# EAGLE design control_rev_3 (EAGLE 6.3)
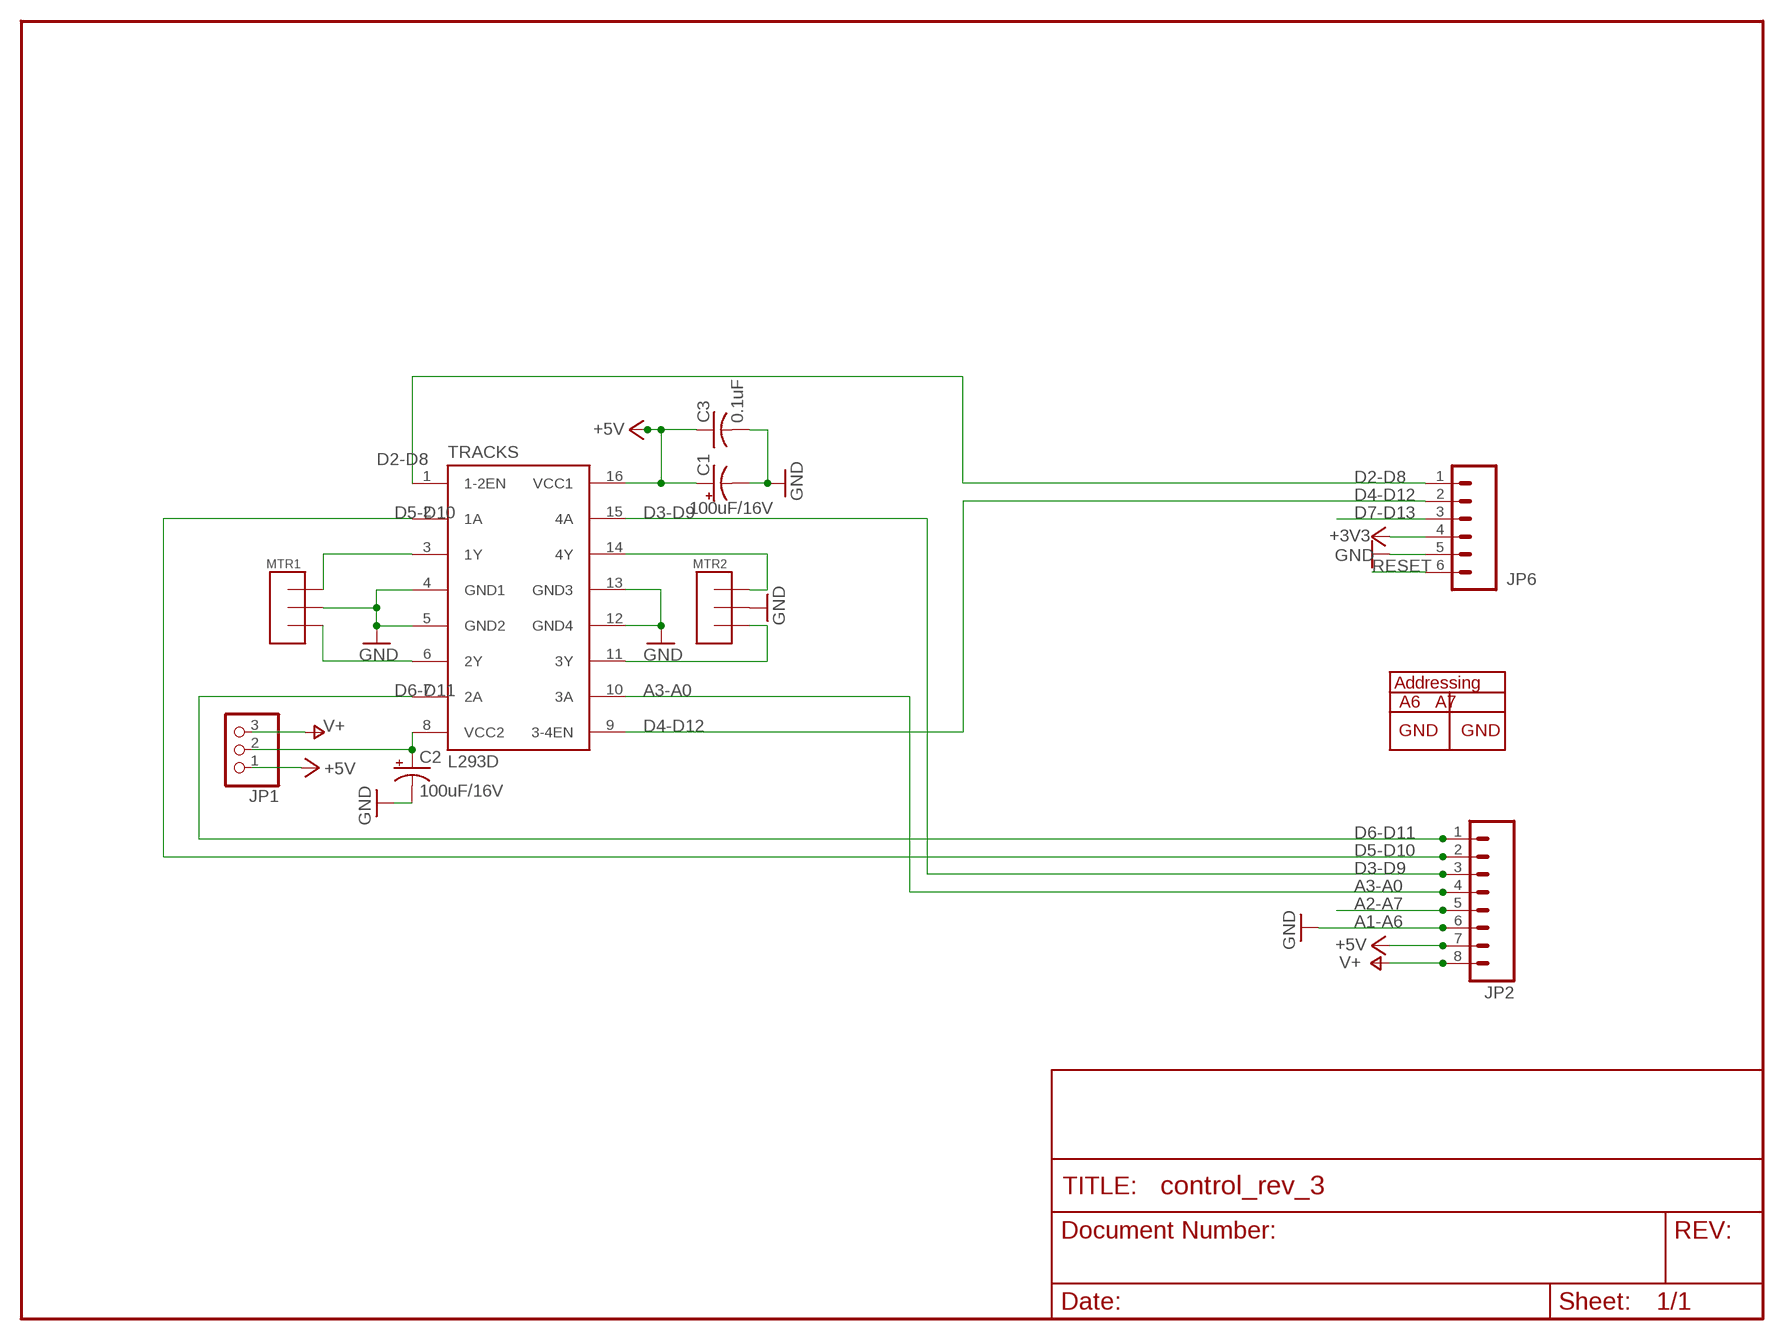
[diagram p0: schematic, sheet 1]

## Parts
C1  100uF/16V  CPOL-USE2.5-6  [E2,5-6]
C2  100uF/16V  CPOL-USE2.5-6  [E2,5-6]
C3  0.1uF  C-US025-025X050  [C025-025X050]
JP1  PINHD-1X3  [1X03]
JP2  M081X08  [1X08]
JP6  M06SIP  [1X06]
MTR1  TERMINAL  [TERMINAL_3]
MTR2  TERMINAL  [TERMINAL_3]
TRACKS  L293D  L293E  [DIL16]

## Nets
+3V3: JP6.4
+5V: C1.+ C3.1 JP1.1 JP2.7 TRACKS.16(VCC1)
A1-A6: JP2.6 ; supply symbol labelled GND
A2-A7: JP2.5
A3-A0: JP2.4 TRACKS.10(3A)
D2-D8: JP6.1 TRACKS.1(1-2EN)
D3-D9: JP2.3 TRACKS.15(4A)
D4-D12: JP6.2 TRACKS.9(3-4EN)
D5-D10: JP2.2 TRACKS.2(1A)
D6-D11: JP2.1 TRACKS.7(2A)
D7-D13: JP6.3
GND: C1.- C2.- C3.2 JP6.5 MTR1.P$2 MTR2.P$2 TRACKS.4(GND1) TRACKS.5(GND2) TRACKS.12(GND4) TRACKS.13(GND3)
N$1: MTR1.P$1 TRACKS.3(1Y)
N$2: MTR2.P$1 TRACKS.14(4Y)
N$3: MTR1.P$3 TRACKS.6(2Y)
N$4: MTR2.P$3 TRACKS.11(3Y)
N$8: C2.+ JP1.2 TRACKS.8(VCC2)
RESET: JP6.6
V+: JP1.3 JP2.8

## Library data of the parts
C1 C2 = rcl-ez:CPOL-US: POLARIZED CAPACITOR, American symbol
C3 = rcl-ez:C-US: CAPACITOR, American symbol
JP1 = adafruit_mod:PINHD-1X3: PIN HEADER
JP2 = SparkFun:M08: Header 8 Standard 8-pin 0.1" header. Use with straight break away headers (SKU : PRT-00116), right angle break away headers (PRT-00553), swiss pins (PRT-00743), machine pins (PRT-00117), and female headers (PRT-00115).
JP6 = SparkFun:M06: Header 6 Standard 6-pin 0.1" header. Use with straight break away headers (SKU : PRT-00116), right angle break away headers (PRT-00553), swiss pins (PRT-00743), machine pins (PRT-00117), and female headers (PRT-00115). Molex polarized connector foot print use with SKU : PRT-08094 with associated crimp pins and housings. NOTES ON THE VARIANTS LOCK and LOCK_LONGPADS... This footprint was designed to help hold the alignment of a through-hole component (i.e. 6-pin header) while soldering it into place. You may notice that each hole has been shifted either up or down by 0.005 of an inch from it's more standard position (which is a perfectly straight line). This slight alteration caused the pins (the squares in the middle) to touch the edges of the holes. Because they are alternating, it causes a "brace" to hold the component in place. 0.005 has proven to be the perfect amount of "off-center" position when using our standard breakaway headers. Although looks a little odd when you look at the bare footprint, once you have a header in there, the alteration is very hard to notice. Also, if you push a header all the way into place, it is covered up entirely on the bottom side. This idea of altering the position of holes to aid alignment will be further integrated into the Sparkfun Library for other footprints. It can help hold any component with 3 or more connection pins.
MTR1 MTR2 = _my-parts:TERMINAL
TRACKS = texas:L293E: TI DEVICE

## Net classes
0 default: width 0.203 mm
1 vcc: width 0.254 mm

## Board
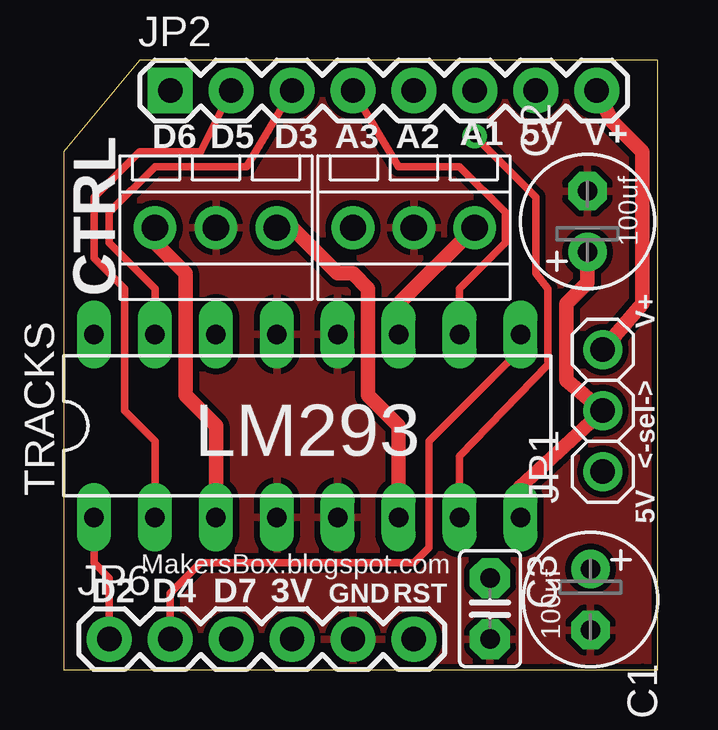
[diagram p1: board, top side]
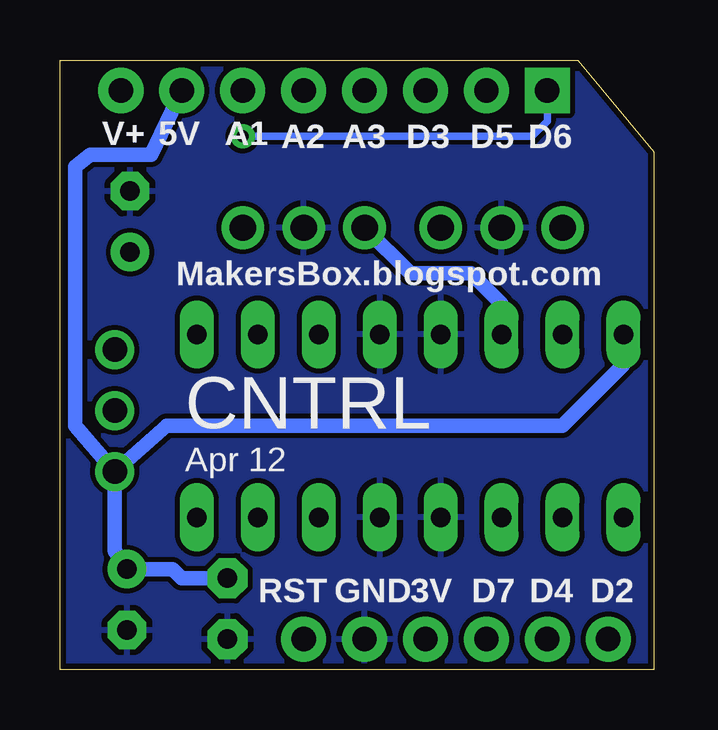
[diagram p2: board, bottom side, seen from below]

Size 24.77 x 25.4 mm. Coordinates in mm from the lower left corner, seen from the top.
Outline: 24.76,25.4 24.76,21.59 24.76,0 24.13,0 20.32,0 0,0 0,21.59
Outline: 24.76,25.4 3.17,25.4 0,21.59
Outline: 0,21.59 0,21.59
Copper layers (1*16): Top 0.035mm / dielectric 1.5mm / Bottom 0.035mm
Design rules "SparkFun": minimum track width 8mil, minimum drill 20mil, track to track 8mil, track to pad 8mil, pad to pad 8mil, via to via 8mil, smd to smd 8mil, copper to edge 10mil, drill to drill 8mil, minimum pad ring 12mil, minimum via ring 10mil, stop-mask expansion 4mil, vias tented up to drill 25mil, thermal gap 10mil

### Footprints (pad centres in the part's own frame; a part is rotated, then mirrored left to right if it is on the bottom)
E2,5-6 = drill 0.813 pad 1.6: + -1.27,0 | drill 0.813 pad 1.6 octagon: - 1.27,0
C025-025X050 = drill 0.813 pad 1.676 octagon: 1 -1.27,0; 2 1.27,0
1X03 = drill 1.016: 1 -2.54,0; 2 0,0; 3 2.54,0
1X08 = drill 1.016 pad 1.88 square: 1 0,0 | drill 1.016 pad 1.88: 2 2.54,0; 3 5.08,0; 4 7.62,0; 5 10.16,0; 6 12.7,0; 7 15.24,0; 8 17.78,0
1X06 = drill 1.016 pad 1.88: 1 0,0; 2 2.54,0; 3 5.08,0; 4 7.62,0; 5 10.16,0; 6 12.7,0
TERMINAL_3 = drill 1.1 pad 1.778: P$1 -2.54,0; P$2 0,0; P$3 2.54,0
DIL16 = drill 0.813 long: 1 -8.89,-3.81; 2 -6.35,-3.81; 3 -3.81,-3.81; 4 -1.27,-3.81; 5 1.27,-3.81; 6 3.81,-3.81; 7 6.35,-3.81; 8 8.89,-3.81; 9 8.89,3.81; 10 6.35,3.81; 11 3.81,3.81; 12 1.27,3.81; 13 -1.27,3.81; 14 -3.81,3.81; 15 -6.35,3.81; 16 -8.89,3.81

### Placement (x,y rotation side)
C1  21.97,2.92 270 top
C2  21.84,18.67 90 top
C3  17.78,2.54 270 top
JP1  22.48,10.79 90 top
JP2  4.45,24.13 0 top
JP6  1.91,1.27 0 top
MTR1  6.35,18.41 0 top
MTR2  14.61,18.41 0 top
TRACKS  10.16,10.16 0 top

### Tracks (layer width: path | path; a pad name or v marks a point on that pad's centre or on a via)
+5V
  Bottom 0.61: TRACKS.16 1.27,12.7 3.81,10.16 20.32,10.16 JP1.1 | JP2.7 20.95,21.46 23.49,21.46 24.13,20.95 24.13,10.16 JP1.1 | JP1.1 22.48,4.95 C1.+ 20.07,4.19 19.68,3.81 C3.1
A3-A0
  Top 0.305: TRACKS.10 16.51,15.88 18.41,17.78 18.41,19.05 16.51,20.95 13.97,20.95 JP2.4
D2-D8
  Top 0.305: TRACKS.1 1.27,4.45 1.91,3.81 JP6.1
D3-D9
  Top 0.305: TRACKS.15 3.81,15.88 1.91,17.78 1.91,19.05 3.81,20.95 7.62,20.95 JP2.3
D4-D12
  Top 0.305: JP6.2 4.45,3.17 5.71,4.45 14.61,4.45 15.24,5.08 15.24,9.53 19.05,13.34 TRACKS.9
D5-D10
  Top 0.305: JP2.2 5.71,21.59 3.17,21.59 1.27,19.68 1.27,17.14 2.54,15.88 2.54,10.79 3.81,9.53 TRACKS.2
D6-D11  (via drill 0.51)
  Top 0.305: TRACKS.7 16.51,8.89 20.19,12.7 20.19,15.88 19.68,16.51 19.68,19.68 v17.14,22.23
  Bottom 0.305: JP2.1 4.45,22.86 5.08,22.23 v17.14,22.23
GND
  pour Bottom: -1.91,26.67 26.04,26.67 26.04,-1.27 -1.91,-1.27
  pour Top (isolate 0.254): -1.27,26.04 26.04,26.04 26.04,0 25.4,-0.64 -1.27,-0.64
N$1
  Top 0.61: MTR1.P$1 3.81,17.78 5.08,16.51 5.08,11.43 6.35,10.16 TRACKS.3
N$2
  Bottom 0.61: TRACKS.14 6.35,15.24 7.62,16.51 10.16,16.51 MTR2.P$1
N$3
  Top 0.61: MTR1.P$3 9.53,18.41 11.43,16.51 12.06,16.51 12.7,15.88 12.7,11.43 13.97,10.16 TRACKS.6
N$4
  Top 0.61: TRACKS.11 13.97,15.24 MTR2.P$3
N$8
  Top 0.61: C2.+ 21.84,16.13 20.95,15.24 20.95,12.06 JP1.2 19.05,7.62 TRACKS.8
V+
  Top 0.61: JP2.8 22.86,22.86 24.13,21.59 24.13,15.24 JP1.3

### Text on the board
tPlace: CTRL | D6 | D5 | D3 | A3 | A2 | A1 | 5V | V+ | 100uf | V+ | LM293 | <-sel-> | 5V | MakersBox.blogspot.com | D2 | D4 | D7 | 3V | GND | RST | 100uf
bPlace: D6 | D5 | D3 | A3 | A2 | 5V | V+ | A1 | MakersBox.blogspot.com | CNTRL | Apr 12 | D2 | D4 | D7 | 3V | GND | RST